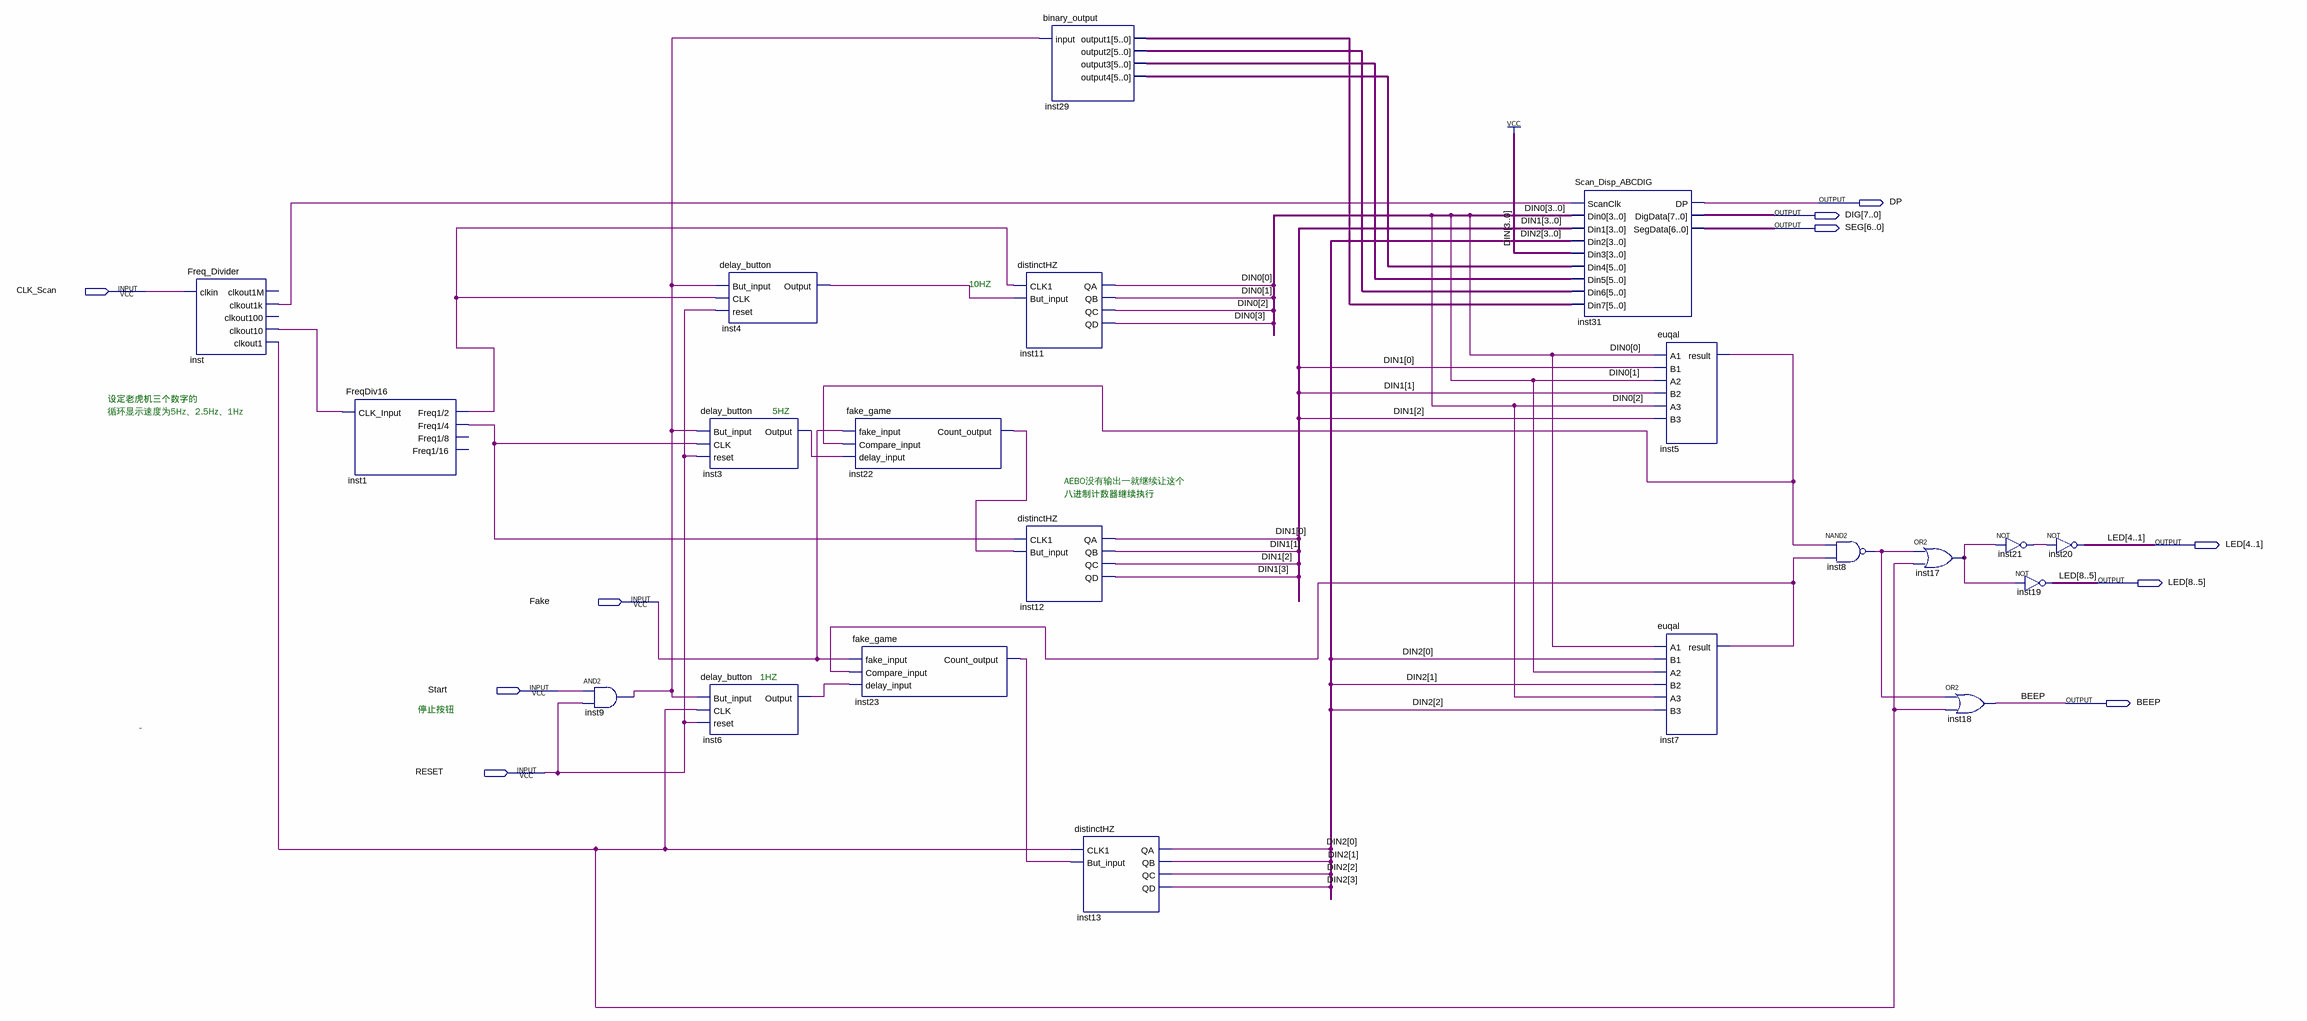
[diagram p0: schematic sheet]
// Quartus schematic tigger_game.bdf as structural Verilog: 21 symbols, 10 pins
module tigger_game (
  input  CLK_Scan,
  input  Fake,
  input  Start,
  input  RESET,
  output DP,
  output [7:0] DIG,
  output [6:0] SEG,
  output [8:1] LED,
  output BEEP
);

  wire inst1_freq1_2, inst1_freq1_4, inst3_output, inst4_output, inst5_result, inst6_output, inst7_result,
       inst8_out, inst9_out, inst17_out, inst21_out, inst22_count_output, inst23_count_output, inst_clkout1,
       inst_clkout1k, inst_clkout10;
  wire [3:0] DIN0, DIN1, DIN2;
  wire [5:0] inst29_output1, inst29_output2, inst29_output3, inst29_output4;

  Freq_Divider inst (
    .clkin(CLK_Scan), .clkout1k(inst_clkout1k), .clkout10(inst_clkout10), .clkout1(inst_clkout1));  // open: clkout1M, clkout100
  FreqDiv16 inst1 (
    .CLK_Input(inst_clkout10), .\Freq1/2 (inst1_freq1_2), .\Freq1/4 (inst1_freq1_4));  // open: Freq1/8, Freq1/16
  and inst9 (inst9_out, Start, RESET);
  delay_button inst4 (.But_input(inst9_out), .CLK(inst1_freq1_2), .reset(RESET), .Output(inst4_output));
  delay_button inst3 (.But_input(inst9_out), .CLK(inst1_freq1_4), .reset(RESET), .Output(inst3_output));
  delay_button inst6 (.But_input(inst9_out), .CLK(inst_clkout1), .reset(RESET), .Output(inst6_output));
  fake_game inst22 (
    .fake_input(Fake), .Compare_input(inst5_result), .delay_input(inst3_output),
    .Count_output(inst22_count_output));
  fake_game inst23 (
    .fake_input(Fake), .Compare_input(inst7_result), .delay_input(inst6_output),
    .Count_output(inst23_count_output));
  distinctHZ inst11 (
    .CLK1(inst1_freq1_2), .But_input(inst4_output), .QA(DIN0[0]), .QB(DIN0[1]), .QC(DIN0[2]), .QD(DIN0[3]));
  distinctHZ inst12 (
    .CLK1(inst1_freq1_4), .But_input(inst22_count_output), .QA(DIN1[0]), .QB(DIN1[1]), .QC(DIN1[2]),
    .QD(DIN1[3]));
  binary_output inst29 (
    .\input (inst9_out), .output1(inst29_output1), .output2(inst29_output2), .output3(inst29_output3),
    .output4(inst29_output4));
  distinctHZ inst13 (
    .CLK1(inst_clkout1), .But_input(inst23_count_output), .QA(DIN2[0]), .QB(DIN2[1]), .QC(DIN2[2]),
    .QD(DIN2[3]));
  Scan_Disp_ABCDIG inst31 (
    .ScanClk(inst_clkout1k), .Din0(DIN0), .Din1(DIN1), .Din2(DIN2), .Din3(4'b1111), .Din4(inst29_output4),
    .Din5(inst29_output3), .Din6(inst29_output2), .Din7(inst29_output1), .DP(DP), .DigData(DIG), .SegData(SEG));
  euqal inst5 (
    .A1(DIN0[0]), .B1(DIN1[0]), .A2(DIN0[1]), .B2(DIN1[1]), .A3(DIN0[2]), .B3(DIN1[2]), .result(inst5_result));
  euqal inst7 (
    .A1(DIN0[0]), .B1(DIN2[0]), .A2(DIN0[1]), .B2(DIN2[1]), .A3(DIN0[2]), .B3(DIN2[2]), .result(inst7_result));
  nand inst8 (inst8_out, inst5_result, inst7_result);
  or inst17 (inst17_out, inst8_out, inst_clkout1);
  or inst18 (BEEP, inst8_out, inst_clkout1);
  not inst21 (inst21_out, inst17_out);
  assign LED[8:5] = ~{4{inst17_out}};  // NOT inst19, 4 bits wide
  assign LED[4:1] = ~{4{inst21_out}};  // NOT inst20, 4 bits wide

  // Notes on the sheet:
  //   10HZ
  //   设定老虎机三个数字的
  //   循环显示速度为5Hz、2.5Hz、1Hz
  //   5HZ
  //   AEBO没有输出一就继续让这个
  //   八进制计数器继续执行
  //   1HZ
  //   停止按钮
  //   -
endmodule
